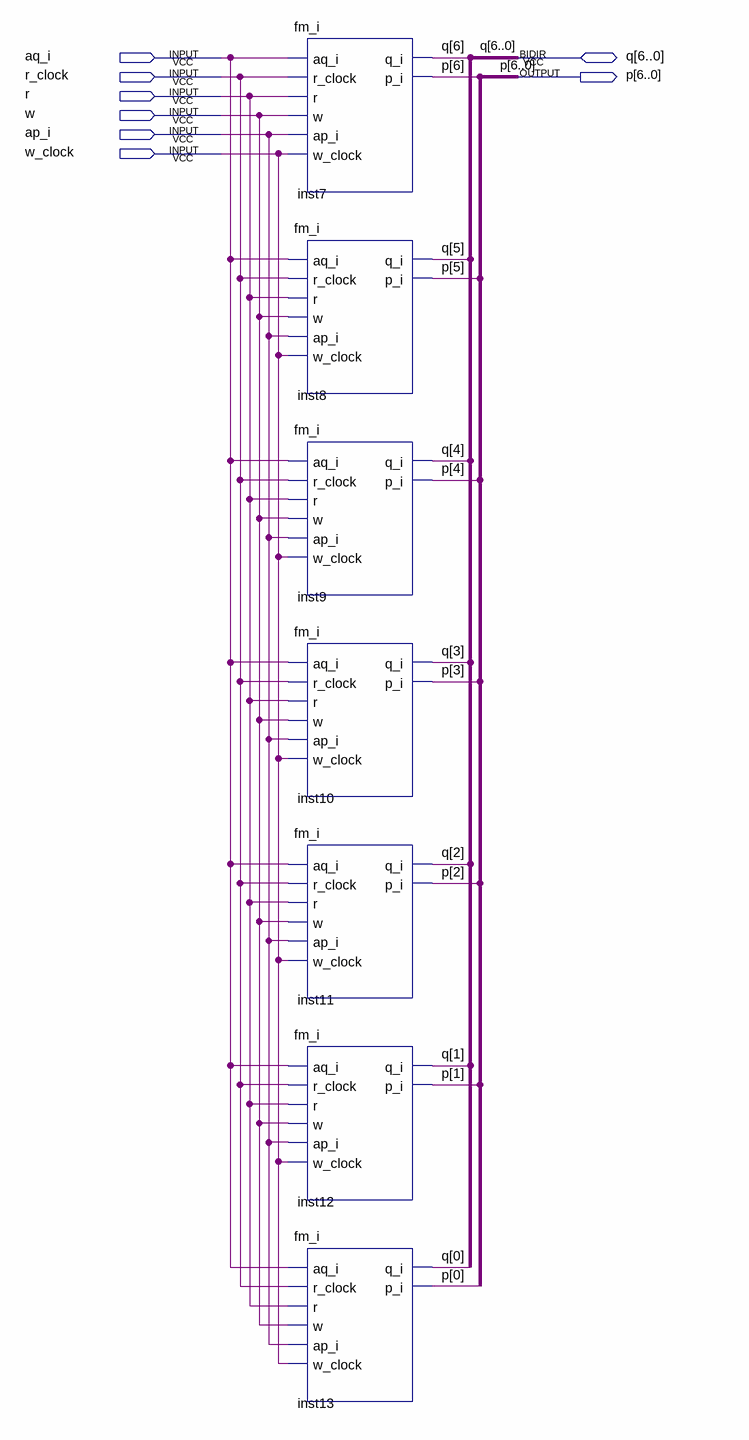
[diagram p0: schematic sheet]
// Quartus schematic fm_7.bdf as structural Verilog: 7 symbols, 8 pins
module fm_7 (
  input  aq_i,
  input  r_clock,
  input  r,
  input  w,
  input  ap_i,
  input  w_clock,
  inout  [6:0] q,
  output [6:0] p
);

  fm_i inst7 (.aq_i(aq_i), .r_clock(r_clock), .r(r), .w(w), .ap_i(ap_i), .w_clock(w_clock), .p_i(p[6]), .q_i(q[6]));
  fm_i inst8 (.aq_i(aq_i), .r_clock(r_clock), .r(r), .w(w), .ap_i(ap_i), .w_clock(w_clock), .p_i(p[5]), .q_i(q[5]));
  fm_i inst9 (.aq_i(aq_i), .r_clock(r_clock), .r(r), .w(w), .ap_i(ap_i), .w_clock(w_clock), .p_i(p[4]), .q_i(q[4]));
  fm_i inst10 (.aq_i(aq_i), .r_clock(r_clock), .r(r), .w(w), .ap_i(ap_i), .w_clock(w_clock), .p_i(p[3]), .q_i(q[3]));
  fm_i inst11 (.aq_i(aq_i), .r_clock(r_clock), .r(r), .w(w), .ap_i(ap_i), .w_clock(w_clock), .p_i(p[2]), .q_i(q[2]));
  fm_i inst12 (.aq_i(aq_i), .r_clock(r_clock), .r(r), .w(w), .ap_i(ap_i), .w_clock(w_clock), .p_i(p[1]), .q_i(q[1]));
  fm_i inst13 (.aq_i(aq_i), .r_clock(r_clock), .r(r), .w(w), .ap_i(ap_i), .w_clock(w_clock), .p_i(p[0]), .q_i(q[0]));
endmodule
